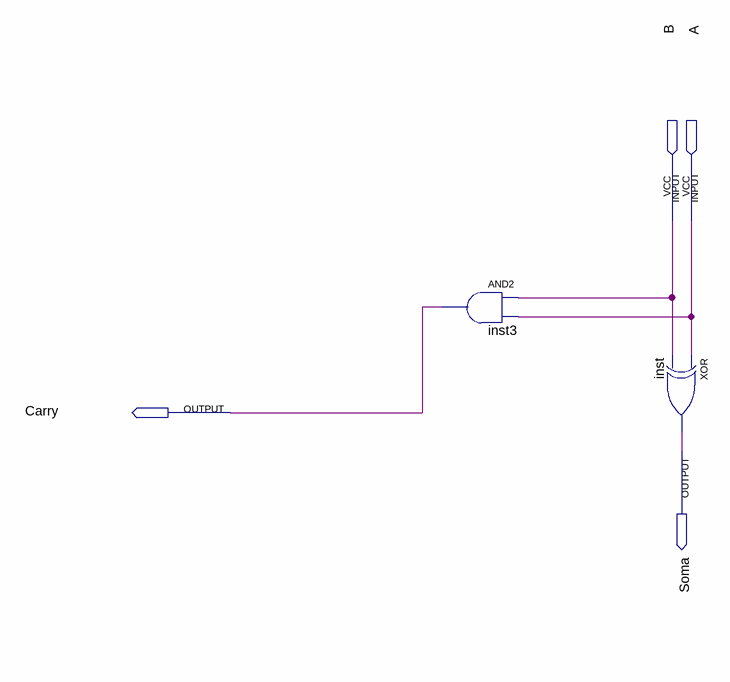
[diagram p0: schematic sheet]
// Quartus schematic soma1.bdf as structural Verilog: 2 symbols, 4 pins
module soma1 (
  input  B,
  input  A,
  output Carry,
  output Soma
);

  and inst3 (Carry, B, A);
  xor inst (Soma, A, B);
endmodule
